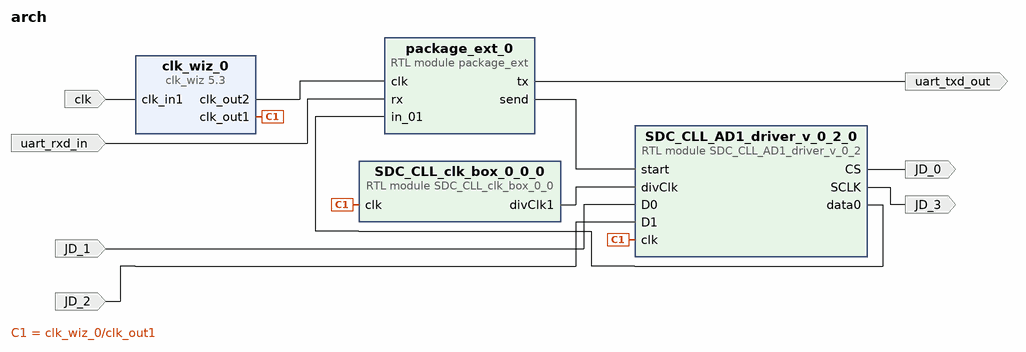
[diagram p0: block diagram of the top level]
# Vivado block design arch, Vivado 2016.1
create_bd_design arch

create_bd_port -dir I -type clk clk
create_bd_port -dir O uart_txd_out
create_bd_port -dir I uart_rxd_in
create_bd_port -dir I JD_1
create_bd_port -dir I JD_2
create_bd_port -dir O JD_0
create_bd_port -dir O JD_3

create_bd_cell -type module -reference SDC_CLL_AD1_driver_v_0_2 SDC_CLL_AD1_driver_v_0_2_0
create_bd_cell -type module -reference SDC_CLL_clk_box_0_0 SDC_CLL_clk_box_0_0_0
create_bd_cell -type ip -vlnv xilinx.com:ip:clk_wiz:5.3 clk_wiz_0
set_property -dict [list \
  CONFIG.CLKOUT2_USED true \
  CONFIG.NUM_OUT_CLKS 2 \
  CONFIG.CLKOUT1_REQUESTED_OUT_FREQ 60.000 \
  CONFIG.CLKOUT2_REQUESTED_OUT_FREQ 60.000 \
  CONFIG.USE_LOCKED false \
  CONFIG.USE_RESET false \
  CONFIG.MMCM_DIVCLK_DIVIDE 5 \
  CONFIG.MMCM_CLKFBOUT_MULT_F 51.000 \
  CONFIG.MMCM_CLKOUT0_DIVIDE_F 17.000 \
  CONFIG.MMCM_CLKOUT1_DIVIDE 17 \
  CONFIG.CLKOUT1_JITTER 254.384 \
  CONFIG.CLKOUT1_PHASE_ERROR 300.046 \
  CONFIG.CLKOUT2_JITTER 254.384 \
  CONFIG.CLKOUT2_PHASE_ERROR 300.046 \
] [get_bd_cells clk_wiz_0]
create_bd_cell -type module -reference package_ext package_ext_0
set_property -dict {CONFIG.BAUD 3126} [get_bd_cells package_ext_0]

# ---- connections ----

connect_bd_net -net clk_in1_1 [get_bd_ports clk] [get_bd_pins clk_wiz_0/clk_in1]
connect_bd_net [get_bd_pins clk_wiz_0/clk_out2] [get_bd_pins package_ext_0/clk]
connect_bd_net [get_bd_pins package_ext_0/tx] [get_bd_ports uart_txd_out]
connect_bd_net -net rx_1 [get_bd_ports uart_rxd_in] [get_bd_pins package_ext_0/rx]
connect_bd_net [get_bd_pins package_ext_0/send] [get_bd_pins SDC_CLL_AD1_driver_v_0_2_0/start]
connect_bd_net [get_bd_pins clk_wiz_0/clk_out1] [get_bd_pins SDC_CLL_clk_box_0_0_0/clk] [get_bd_pins SDC_CLL_AD1_driver_v_0_2_0/clk]
connect_bd_net -net D0_1 [get_bd_ports JD_1] [get_bd_pins SDC_CLL_AD1_driver_v_0_2_0/D0]
connect_bd_net -net D1_1 [get_bd_ports JD_2] [get_bd_pins SDC_CLL_AD1_driver_v_0_2_0/D1]
connect_bd_net [get_bd_pins SDC_CLL_AD1_driver_v_0_2_0/CS] [get_bd_ports JD_0]
connect_bd_net [get_bd_pins SDC_CLL_AD1_driver_v_0_2_0/SCLK] [get_bd_ports JD_3]
connect_bd_net [get_bd_pins SDC_CLL_clk_box_0_0_0/divClk1] [get_bd_pins SDC_CLL_AD1_driver_v_0_2_0/divClk]
connect_bd_net [get_bd_pins SDC_CLL_AD1_driver_v_0_2_0/data0] [get_bd_pins package_ext_0/in_01]

validate_bd_design
save_bd_design
